# EAGLE board gustav2.0 (EAGLE 7.3.0), part 1 of 2
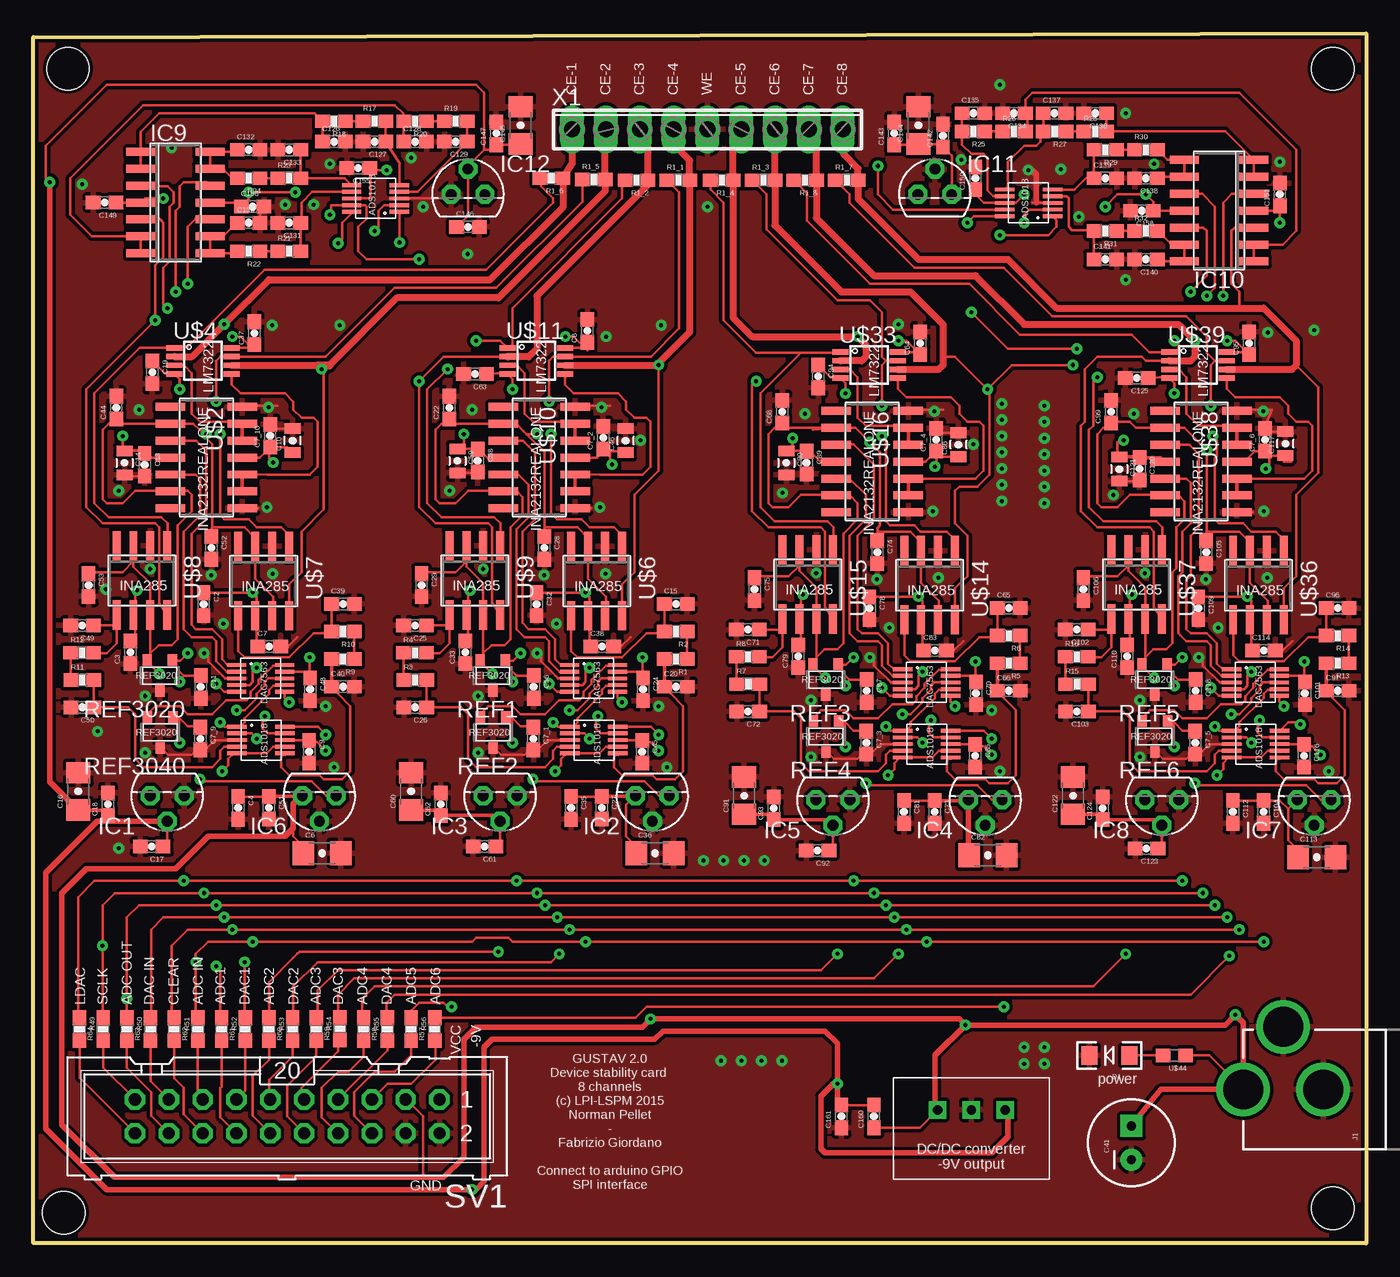
[diagram p3: board, top side]
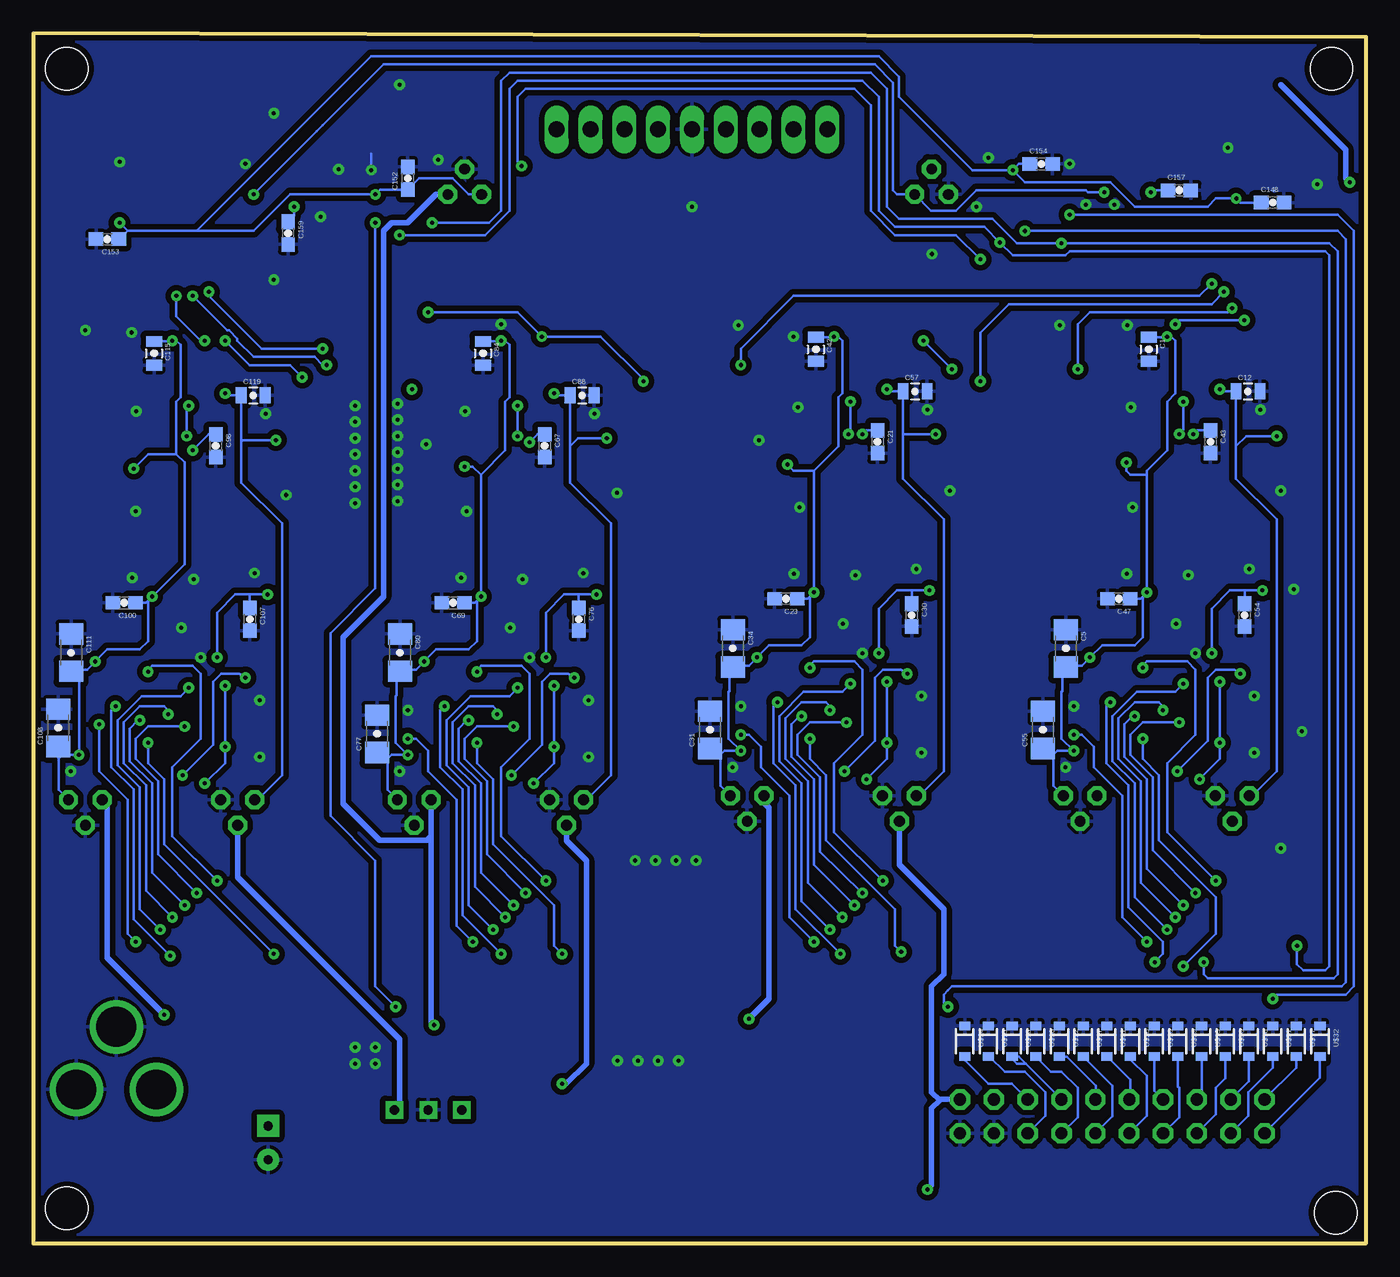
[diagram p4: board, bottom side, seen from below]

Size 100.06 x 90.82 mm. Coordinates in mm from the lower left corner, seen from the top.
Outline: 0,90.54 100.06,90.82 100.06,0 0,0.03 0,90.54
Copper layers (1*16): Top 0.035mm / dielectric 1.5mm / Bottom 0.035mm
Design rules "SparkFun *": minimum track width 8mil, minimum drill 20mil, track to track 6mil, track to pad 6mil, pad to pad 6mil, via to via 6mil, smd to smd 6mil, copper to edge 10mil, drill to drill 8mil, minimum pad ring 12mil, minimum via ring 10mil, stop-mask expansion 4mil, vias tented up to drill 25mil, thermal gap 10mil
Holes 3.2 mm at 2.6,88.18 2.3,2.32 97.55,88.18 97.55,2.63

## Footprints (pad centres in the part's own frame; a part is rotated, then mirrored left to right if it is on the bottom)
0805-CAP = smd 0.8 x 1.2: 1 -0.9,0; 2 0.9,0
0603-CAP = smd 1.1 x 1: 1 -0.85,0; 2 0.85,0
1206-CAP = smd 1.6 x 1.8: 1 -1.4,0; 2 1.4,0
CPOL-RADIAL-100UF-25V = drill 0.7 pad 1.651 square: 1 1.27,0 | drill 0.7 pad 1.651: 2 -1.27,0
LED-1206 = smd 1.2 x 1.4: A -1.5,0; C 1.5,0
TO92 = drill 0.813 octagon: 1 -1.27,0; 2 0,1.905; 3 1.27,0
SO14 = smd 0.6 x 2.2: 1 -3.81,-2.6; 2 -2.54,-2.6; 3 -1.27,-2.6; 4 0,-2.6; 5 1.27,-2.6; 6 2.54,-2.6; 7 3.81,-2.6; 8 3.81,2.6; 9 2.54,2.6; 10 1.27,2.6; 11 0,2.6; 12 -1.27,2.6; 13 -2.54,2.6; 14 -3.81,2.6
POWER_JACK_PTH = drill 2.997: GND 0,7.7; GNDBREAK 4.7,10.7; PWR 0,13.7
0603-RES = smd 1.1 x 1: 1 -0.85,0; 2 0.85,0
DBZ_R-PDSO-G3 = smd 0.7 x 1: 1 -0.95,-1.1; 2 0.95,-1.1; 3 0,1.1
ML20 = drill 0.914 octagon: 1 -11.43,-1.27; 2 -11.43,1.27; 3 -8.89,-1.27; 4 -8.89,1.27; 5 -6.35,-1.27; 6 -6.35,1.27; 7 -3.81,-1.27; 8 -3.81,1.27; 9 -1.27,-1.27; 10 -1.27,1.27; 11 1.27,-1.27; 12 1.27,1.27; 13 3.81,-1.27; 14 3.81,1.27; 15 6.35,-1.27; 16 6.35,1.27; 17 8.89,-1.27; 18 8.89,1.27; 19 11.43,-1.27; 20 11.43,1.27
S-PDSO-G10 = smd 0.28 x 1.45: P1 -1,-1.8; P2 -0.5,-1.8; P3 0,-1.8; P4 0.5,-1.8; P5 1,-1.8; P6 1,1.8; P7 0.5,1.8; P8 0,1.8; P9 -0.5,1.8; P10 -1,1.8
SO-14 = smd 0.6 x 2.2: 1 -3.81,-2.695; 2 -2.54,-2.695; 3 -1.27,-2.695; 4 0,-2.695; 5 1.27,-2.695; 6 2.54,-2.695; 7 3.81,-2.7; 8 3.81,2.7; 9 2.54,2.7; 10 1.27,2.7; 11 0,2.7; 12 -1.27,2.7; 13 -2.54,2.7; 14 -3.81,2.7
S-PDSO-G08-NOTHERMALPAD = smd 0.4 x 1.2: 1 -0.975,-2.157; 2 -0.325,-2.157; 3 0.325,-2.157; 4 0.975,-2.157; 5 0.975,2.157; 6 0.325,2.157; 7 -0.325,2.157; 8 -0.975,2.157
SO-08 = smd 0.6 x 2.2: 1 -1.905,-2.6; 2 -0.635,-2.6; 3 0.635,-2.6; 4 1.905,-2.6; 5 1.905,2.6; 6 0.635,2.6; 7 -0.635,2.6; 8 -1.905,2.6
SOD-323 = smd 0.63 x 0.83: 1 -1.15,0; 2 1.15,0
TSRN1 = drill 0.7 square: P$1 -2.54,1.397; P$2 0,1.397; P$3 2.54,1.397
0603 = smd 1.1 x 1: 1 -0.85,0; 2 0.85,0
9POL254 = drill 1.2 long: 1 -10.16,0; 2 -7.62,0; 3 -5.08,0; 4 -2.54,0; 5 0,0; 6 2.54,0; 7 5.08,0; 8 7.62,0; 9 10.16,0

## Placement (x,y rotation side)
C1  0.33uF  [0805-CAP]  16.32,67.11 270 bottom
C2  0.1uF  [0603-CAP]  12.79,47.98 270 top
C3  0.1uF  [0603-CAP]  7.29,44.37 90 top
C4  [0603-CAP]  15.38,32.69 270 top
C5  100uF  [1206-CAP]  22.56,44.65 270 bottom
C6  100uF  [1206-CAP]  21.68,29.29 0 top
C7  0.1uF  [0603-CAP]  17.72,44.81 0 top
C7_1  10uF  [0603-CAP]  37.54,37.9 270 top
C7_2  10uF  [0603-CAP]  42.79,60.46 90 top
C7_3  10uF  [0603-CAP]  62.53,37.59 270 top
C7_4  10uF  [0603-CAP]  67.78,60.31 90 top
C7_5  10uF  [0603-CAP]  87.22,37.59 270 top
C7_6  10uF  [0603-CAP]  92.47,60.31 90 top
C7_9  10uF  [0603-CAP]  12.55,37.9 270 top
C7_10  10uF  [0603-CAP]  17.79,60.62 90 top
C8  0.1uF  [0603-CAP]  41.59,68.48 90 top
C9  [0603-CAP]  20.71,36.91 270 top
C10  0.33uF  [0805-CAP]  19.47,60.25 90 top
C11  [0603-CAP]  12.57,41.77 270 top
C12  0.33uF  [0805-CAP]  8.88,63.94 0 bottom
C13  [0603-CAP]  8.37,58.45 270 top
C14  0.33uF  [0805-CAP]  6.85,58.57 270 top
C15  0.22uF  [0603-CAP]  48.23,47.99 0 top
C16  100uF  [1206-CAP]  3.38,33.92 90 top
C17  [0603-CAP]  8.89,29.79 180 top
C18  [0603-CAP]  5.6,32.97 90 top
C19  0.1uF  [0603-CAP]  8.94,65.38 270 top
C20  0.22uF  [0603-CAP]  48.23,41.78 0 top
C21  0.1uF  [0603-CAP]  36.68,60.17 270 bottom
C22  0.1uF  [0603-CAP]  31.23,62.73 90 top
C23  0.1uF  [0603-CAP]  43.56,48.39 180 bottom
C24  0.1uF  [0603-CAP]  45.78,41.59 270 top
C25  0.22uF  [0603-CAP]  28.65,46.38 180 top
C26  0.22uF  [0603-CAP]  28.68,40.23 180 top
C27  [0603-CAP]  42.68,32.7 270 top
C28  0.1uF  [0603-CAP]  38.37,52.19 270 top
C29  0.1uF  [0603-CAP]  29.15,49.42 270 top
C30  1uF  [0603-CAP]  34.12,47.16 270 bottom
C31  100uF  [1206-CAP]  49.26,38.54 90 bottom
C32  0.1uF  [0603-CAP]  37.78,47.98 270 top
C33  0.1uF  [0603-CAP]  32.44,44.37 90 top
C34  100uF  [1206-CAP]  47.55,44.65 270 bottom
C35  [0603-CAP]  40.37,32.69 270 top
C36  100uF  [1206-CAP]  46.67,29.29 0 top
C37  0.1uF  [0603-CAP]  16.6,68.33 90 top
C38  0.1uF  [0603-CAP]  42.71,44.81 0 top
C39  0.22uF  [0603-CAP]  23.24,47.99 0 top
C40  0.22uF  [0603-CAP]  23.24,41.78 0 top
C41  [CPOL-RADIAL-100UF-25V]  82.44,7.56 90 top
C42  0.33uF  [0805-CAP]  41.31,67.11 270 bottom
C43  0.1uF  [0603-CAP]  11.69,60.17 270 bottom
C44  0.1uF  [0603-CAP]  6.24,62.73 90 top
C45  [0603-CAP]  45.71,36.91 270 top
C46  0.33uF  [0805-CAP]  44.46,60.25 90 top
C47  0.1uF  [0603-CAP]  18.57,48.39 180 bottom
C48  0.1uF  [0603-CAP]  20.78,41.59 270 top
C49  0.22uF  [0603-CAP]  3.66,46.38 180 top
C50  0.22uF  [0603-CAP]  3.68,40.23 180 top
C51  [0603-CAP]  17.68,32.7 270 top
C52  0.1uF  [0603-CAP]  13.37,52.19 270 top
C53  0.1uF  [0603-CAP]  4.15,49.42 270 top
C54  1uF  [0603-CAP]  9.13,47.16 270 bottom
C55  100uF  [1206-CAP]  24.27,38.54 90 bottom
C56  [0603-CAP]  37.57,41.77 270 top
C57  0.33uF  [0805-CAP]  33.87,63.94 0 bottom
C58  [0603-CAP]  33.36,58.75 270 top
C59  0.33uF  [0805-CAP]  31.84,58.72 270 top
C60  100uF  [1206-CAP]  28.37,33.92 90 top
C61  [0603-CAP]  33.88,29.79 180 top
C62  [0603-CAP]  30.59,32.97 90 top
C63  0.1uF  [0603-CAP]  33.15,65.25 180 top
C64  0.1uF  [0603-CAP]  66.59,67.56 90 top
C65  0.22uF  [0603-CAP]  73.23,47.69 0 top
C66  0.22uF  [0603-CAP]  73.23,41.48 0 top
C67  0.1uF  [0603-CAP]  61.67,59.86 270 bottom
C68  0.1uF  [0603-CAP]  56.22,62.42 90 top
C69  0.1uF  [0603-CAP]  68.55,48.08 180 bottom
C70  0.1uF  [0603-CAP]  70.77,41.29 270 top
C71  0.22uF  [0603-CAP]  53.64,46.08 180 top
C72  0.22uF  [0603-CAP]  53.67,39.93 180 top
C73  [0603-CAP]  67.67,32.39 270 top
C74  0.1uF  [0603-CAP]  63.36,51.89 270 top
C75  0.1uF  [0603-CAP]  54.14,49.11 270 top
C76  1uF  [0603-CAP]  59.12,46.85 270 bottom
C77  100uF  [1206-CAP]  74.26,38.24 90 bottom
C78  0.1uF  [0603-CAP]  62.78,47.68 270 top
C79  0.1uF  [0603-CAP]  57.43,44.07 90 top
C80  100uF  [1206-CAP]  72.54,44.35 270 bottom
C81  [0603-CAP]  65.37,32.38 270 top
C82  100uF  [1206-CAP]  71.67,29.13 0 top
C83  0.1uF  [0603-CAP]  67.7,44.5 0 top
C84  0.33uF  [0805-CAP]  66.31,66.8 270 bottom
C85  [0603-CAP]  70.7,36.6 270 top
C86  0.33uF  [0805-CAP]  69.46,59.94 90 top
C87  [0603-CAP]  62.56,41.47 270 top
C88  0.33uF  [0805-CAP]  58.86,63.64 0 bottom
C89  [0603-CAP]  58.05,58.6 270 top
C90  0.33uF  [0805-CAP]  56.53,58.57 270 top
C91  100uF  [1206-CAP]  53.37,33.62 90 top
C92  [0603-CAP]  58.88,29.49 180 top
C93  [0603-CAP]  55.59,32.66 90 top
C94  0.1uF  [0603-CAP]  58.93,65.07 270 top
C95  0.1uF  [0603-CAP]  91.27,67.56 90 top
C96  0.22uF  [0603-CAP]  97.92,47.69 0 top
C97  0.22uF  [0603-CAP]  97.92,41.48 0 top
C98  0.1uF  [0603-CAP]  86.36,59.86 270 bottom
C99  0.1uF  [0603-CAP]  80.91,62.42 90 top
C100  0.1uF  [0603-CAP]  93.24,48.08 180 bottom
C101  0.1uF  [0603-CAP]  95.46,41.29 270 top
C102  0.22uF  [0603-CAP]  78.33,46.08 180 top
C103  0.22uF  [0603-CAP]  78.36,39.93 180 top
C104  [0603-CAP]  92.36,32.39 270 top
C105  0.1uF  [0603-CAP]  88.05,51.89 270 top
C106  0.1uF  [0603-CAP]  78.83,49.11 270 top
C107  1uF  [0603-CAP]  83.8,46.85 270 bottom
C108  100uF  [1206-CAP]  98.18,38.7 90 bottom
C109  0.1uF  [0603-CAP]  87.46,47.68 270 top
C110  0.1uF  [0603-CAP]  82.12,44.07 90 top
C111  100uF  [1206-CAP]  97.23,44.35 270 bottom
C112  [0603-CAP]  90.06,32.38 270 top
C113  100uF  [1206-CAP]  96.35,28.98 0 top
C114  0.1uF  [0603-CAP]  92.39,44.5 0 top
C115  0.33uF  [0805-CAP]  91,66.8 270 bottom
C116  [0603-CAP]  95.39,36.6 270 top
C117  0.33uF  [0805-CAP]  94.01,60.03 90 top
C118  [0603-CAP]  87.25,41.47 270 top
C119  0.33uF  [0805-CAP]  83.55,63.64 0 bottom
C120  [0603-CAP]  83.05,58.14 270 top
C121  0.33uF  [0805-CAP]  81.52,58.12 270 top
C122  100uF  [1206-CAP]  78.05,33.62 90 top
C123  [0603-CAP]  83.57,29.64 180 top
C124  [0603-CAP]  80.28,32.66 90 top
C125  0.1uF  [0603-CAP]  82.83,64.95 180 top
C126  0.22uF  [0603-CAP]  22.57,82.69 0 top
C127  0.22uF  [0603-CAP]  25.62,82.69 180 top
C128  0.22uF  [0603-CAP]  28.66,82.69 0 top
C129  0.22uF  [0603-CAP]  31.71,82.69 180 top
C130  0.22uF  [0603-CAP]  16.17,76.59 0 top
C131  0.22uF  [0603-CAP]  19.22,76.59 180 top
C132  0.22uF  [0603-CAP]  16.17,82.08 0 top
C133  0.22uF  [0603-CAP]  19.22,82.08 180 top
C134  0.22uF  [0603-CAP]  73.62,84.82 180 top
C135  0.22uF  [0603-CAP]  70.57,84.82 0 top
C136  0.22uF  [0603-CAP]  79.72,84.82 180 top
C137  0.22uF  [0603-CAP]  76.67,84.82 0 top
C138  0.22uF  [0603-CAP]  83.53,79.95 180 top
C139  0.22uF  [0603-CAP]  80.48,79.95 0 top
C140  0.22uF  [0603-CAP]  83.53,73.85 180 top
C141  0.22uF  [0603-CAP]  80.48,73.85 0 top
C142  [0603-CAP]  68.29,83.15 90 top
C143  [0603-CAP]  64.63,83.3 90 top
C144  100uF  [1206-CAP]  66.46,83.91 90 top
C145  100uF  [1206-CAP]  36.59,83.91 90 top
C146  [0603-CAP]  32.63,76.29 0 top
C147  [0603-CAP]  34.76,83.3 90 top
C148  0.1uF  [0603-CAP]  7.02,78.12 0 bottom
C149  0.1uF  [0603-CAP]  5.35,78.12 180 top
C150  0.1uF  [0603-CAP]  70.73,79.95 90 top
C151  0.1uF  [0603-CAP]  93.59,78.73 90 top
C152  0.1uF  [0603-CAP]  71.95,79.95 90 bottom
C153  0.1uF  [0603-CAP]  94.5,75.37 180 bottom
C154  0.1uF  [0603-CAP]  24.4,81.01 0 bottom
C155  0.1uF  [0603-CAP]  24.4,80.71 180 top
C156  0.1uF  [0603-CAP]  16.47,77.81 0 top
C157  0.1uF  [0603-CAP]  14.03,79.03 0 bottom
C158  0.1uF  [0603-CAP]  83.22,77.51 180 top
C159  0.1uF  [0603-CAP]  80.94,75.83 270 bottom
C160  10uF  [0603-CAP]  63.11,9.54 90 top
C161  10uF  [0603-CAP]  60.67,9.54 90 top
D1  RED  [LED-1206]  80.78,14.11 180 top
IC1  [TO92]  10.05,33.6 180 top
IC2  78L05Z  [TO92]  46.47,33.6 180 top
IC3  [TO92]  35.04,33.6 180 top
IC4  78L05Z  [TO92]  71.46,33.3 180 top
IC5  [TO92]  60.03,33.3 180 top
IC6  78L05Z  [TO92]  21.48,33.6 180 top
IC7  78L05Z  [TO92]  96.15,33.3 180 top
IC8  [TO92]  84.72,33.3 180 top
IC9  OPA4277U  [SO14]  10.68,78.12 270 top
IC10  OPA4277U  [SO14]  89.01,77.51 90 top
IC11  78L05Z  [TO92]  67.68,78.73 0 top
IC12  [TO92]  32.63,78.73 0 top
J1  POWER_JACKPTH  [POWER_JACK_PTH]  104.53,11.56 90 top
R1  [0603-RES]  48.23,43.85 180 top
R1_1  1  [0603-RES]  48.43,79.79 0 top
R1_2  1  [0603-RES]  45.29,79.79 180 top
R1_3  1  [0603-RES]  54.83,79.79 0 top
R1_4  1  [0603-RES]  51.69,79.79 180 top
R1_5  1  [0603-RES]  42.08,79.84 0 top
R1_6  1  [0603-RES]  38.89,79.95 180 top
R1_7  1  [0603-RES]  61.07,79.79 0 top
R1_8  1  [0603-RES]  57.94,79.79 180 top
R2  [0603-RES]  48.23,45.92 180 top
R3  [0603-RES]  28.68,42.28 0 top
R4  [0603-RES]  28.65,44.34 0 top
R5  [0603-RES]  73.23,43.55 180 top
R6  [0603-RES]  73.23,45.62 180 top
R7  [0603-RES]  53.67,41.97 0 top
R8  [0603-RES]  53.64,44.03 0 top
R9  [0603-RES]  23.24,43.85 180 top
R10  [0603-RES]  23.24,45.92 180 top
R11  [0603-RES]  3.68,42.28 0 top
R12  [0603-RES]  3.66,44.34 0 top
R13  [0603-RES]  97.92,43.55 180 top
R14  [0603-RES]  97.92,45.62 180 top
R15  [0603-RES]  78.36,41.97 0 top
R16  [0603-RES]  78.33,44.03 0 top
R17  [0603-RES]  25.62,84.21 0 top
R18  [0603-RES]  22.57,84.21 180 top
R19  [0603-RES]  31.71,84.21 0 top
R20  [0603-RES]  28.66,84.21 180 top
R21  [0603-RES]  19.22,74.46 0 top
R22  [0603-RES]  16.17,74.46 180 top
R23  [0603-RES]  19.22,79.95 0 top
R24  [0603-RES]  16.17,79.95 180 top
R25  [0603-RES]  70.57,83.45 180 top
R26  [0603-RES]  73.62,83.45 0 top
R27  [0603-RES]  76.67,83.45 180 top
R28  [0603-RES]  79.72,83.45 0 top
R29  [0603-RES]  80.48,82.08 180 top
R30  [0603-RES]  83.53,82.08 0 top
R31  [0603-RES]  80.48,75.98 180 top
R32  [0603-RES]  83.53,75.98 0 top
R49  15  [0603-RES]  3.47,16.09 270 top
R50  15  [0603-RES]  7.02,16.09 270 top
R51  15  [0603-RES]  10.58,16.09 270 top
R52  15  [0603-RES]  14.14,16.09 270 top
R53  15  [0603-RES]  17.69,16.09 270 top
R54  15  [0603-RES]  21.25,16.09 270 top
R55  15  [0603-RES]  24.8,16.09 270 top
R56  15  [0603-RES]  28.36,16.09 270 top
R57  15  [0603-RES]  30.14,16.09 90 top
R58  15  [0603-RES]  26.58,16.09 90 top
R59  15  [0603-RES]  23.03,16.12 90 top
R60  15  [0603-RES]  19.47,16.09 90 top
R61  15  [0603-RES]  15.91,16.09 90 top
R62  15  [0603-RES]  12.36,16.09 90 top
R63  15  [0603-RES]  8.8,16.09 90 top
R64  15  [0603-RES]  5.25,16.09 90 top
REF1  REF3020  [DBZ_R-PDSO-G3]  34.49,42.62 180 top
REF2  REF3020  [DBZ_R-PDSO-G3]  34.52,38.35 180 top
REF3  REF3020  [DBZ_R-PDSO-G3]  59.49,42.32 180 top
REF4  REF3020  [DBZ_R-PDSO-G3]  59.51,38.05 180 top
REF5  REF3020  [DBZ_R-PDSO-G3]  84.18,42.32 180 top
REF6  REF3020  [DBZ_R-PDSO-G3]  84.2,38.05 180 top
REF3020  REF3020  [DBZ_R-PDSO-G3]  9.5,42.62 180 top
REF3040  REF3020  [DBZ_R-PDSO-G3]  9.53,38.35 180 top
SV1  [ML20]  19.06,9.54 180 top
U$1  ADS1018  [S-PDSO-G10]  17.09,37.78 270 top
U$2  INA2132REALONE  [SO-14]  12.99,58.98 270 top
U$3  DAC7563  [S-PDSO-G10]  17.07,42.41 270 top
U$4  LM7322  [S-PDSO-G08-NOTHERMALPAD]  12.75,66.23 270 top
U$5  ADS1018  [S-PDSO-G10]  42.08,37.78 270 top
U$6  INA285  [SO-08]  42.29,49.71 180 top
U$7  INA285  [SO-08]  17.3,49.71 180 top
U$8  INA285  [SO-08]  8.15,49.76 180 top
U$9  INA285  [SO-08]  33.15,49.76 180 top
U$10  INA2132REALONE  [SO-14]  37.99,58.98 270 top
U$11  LM7322  [S-PDSO-G08-NOTHERMALPAD]  37.74,66.23 270 top
U$12  DAC7563  [S-PDSO-G10]  42.06,42.41 270 top
U$13  ADS1018  [S-PDSO-G10]  67.08,37.48 270 top
U$14  INA285  [SO-08]  67.28,49.4 180 top
U$15  INA285  [SO-08]  58.14,49.45 180 top
U$16  INA2132REALONE  [SO-14]  62.98,58.67 270 top
U$17  DIODE-ZENER-BZT52  [SOD-323]  5.25,15.18 270 bottom
U$18  DIODE-ZENER-BZT52  [SOD-323]  8.8,15.18 270 bottom
U$19  DIODE-ZENER-BZT52  [SOD-323]  12.36,15.18 270 bottom
U$20  DIODE-ZENER-BZT52  [SOD-323]  15.91,15.18 270 bottom
U$21  DIODE-ZENER-BZT52  [SOD-323]  19.47,15.18 270 bottom
U$22  DIODE-ZENER-BZT52  [SOD-323]  23.03,15.18 270 bottom
U$23  DIODE-ZENER-BZT52  [SOD-323]  26.58,15.18 270 bottom
U$24  DIODE-ZENER-BZT52  [SOD-323]  30.14,15.18 270 bottom
U$25  DIODE-ZENER-BZT52  [SOD-323]  28.36,15.18 270 bottom
U$26  DIODE-ZENER-BZT52  [SOD-323]  24.8,15.18 270 bottom
U$27  DIODE-ZENER-BZT52  [SOD-323]  21.25,15.18 270 bottom
U$28  DIODE-ZENER-BZT52  [SOD-323]  17.69,15.18 270 bottom
U$29  DIODE-ZENER-BZT52  [SOD-323]  14.14,15.18 270 bottom
U$30  DIODE-ZENER-BZT52  [SOD-323]  10.58,15.18 270 bottom
U$31  DIODE-ZENER-BZT52  [SOD-323]  7.02,15.18 270 bottom
U$32  DIODE-ZENER-BZT52  [SOD-323]  3.47,15.18 270 bottom
U$33  LM7322  [S-PDSO-G08-NOTHERMALPAD]  62.74,65.93 270 top
U$34  DAC7563  [S-PDSO-G10]  67.06,42.1 270 top
U$35  ADS1018  [S-PDSO-G10]  91.77,37.48 270 top
U$36  INA285  [SO-08]  91.97,49.4 180 top
U$37  INA285  [SO-08]  82.83,49.45 180 top
U$38  INA2132REALONE  [SO-14]  87.67,58.67 270 top
U$39  LM7322  [S-PDSO-G08-NOTHERMALPAD]  87.43,65.93 270 top
U$40  DAC7563  [S-PDSO-G10]  91.74,42.1 270 top
U$41  ADS1018  [S-PDSO-G10]  25.69,78.42 90 top
U$42  ADS1018  [S-PDSO-G10]  74.71,78.09 90 top
U$43  TSRN  [TSRN1]  70.42,8.62 0 top
U$44  0.05OHM-1/5W-1%(0603)  [0603]  85.66,14.11 180 top
X1  [9POL254]  50.61,83.6 0 top